# Altium schematic sheet Temp_sensor.SchDoc
size A4; SheetNumber: 4; SheetTotal: 7
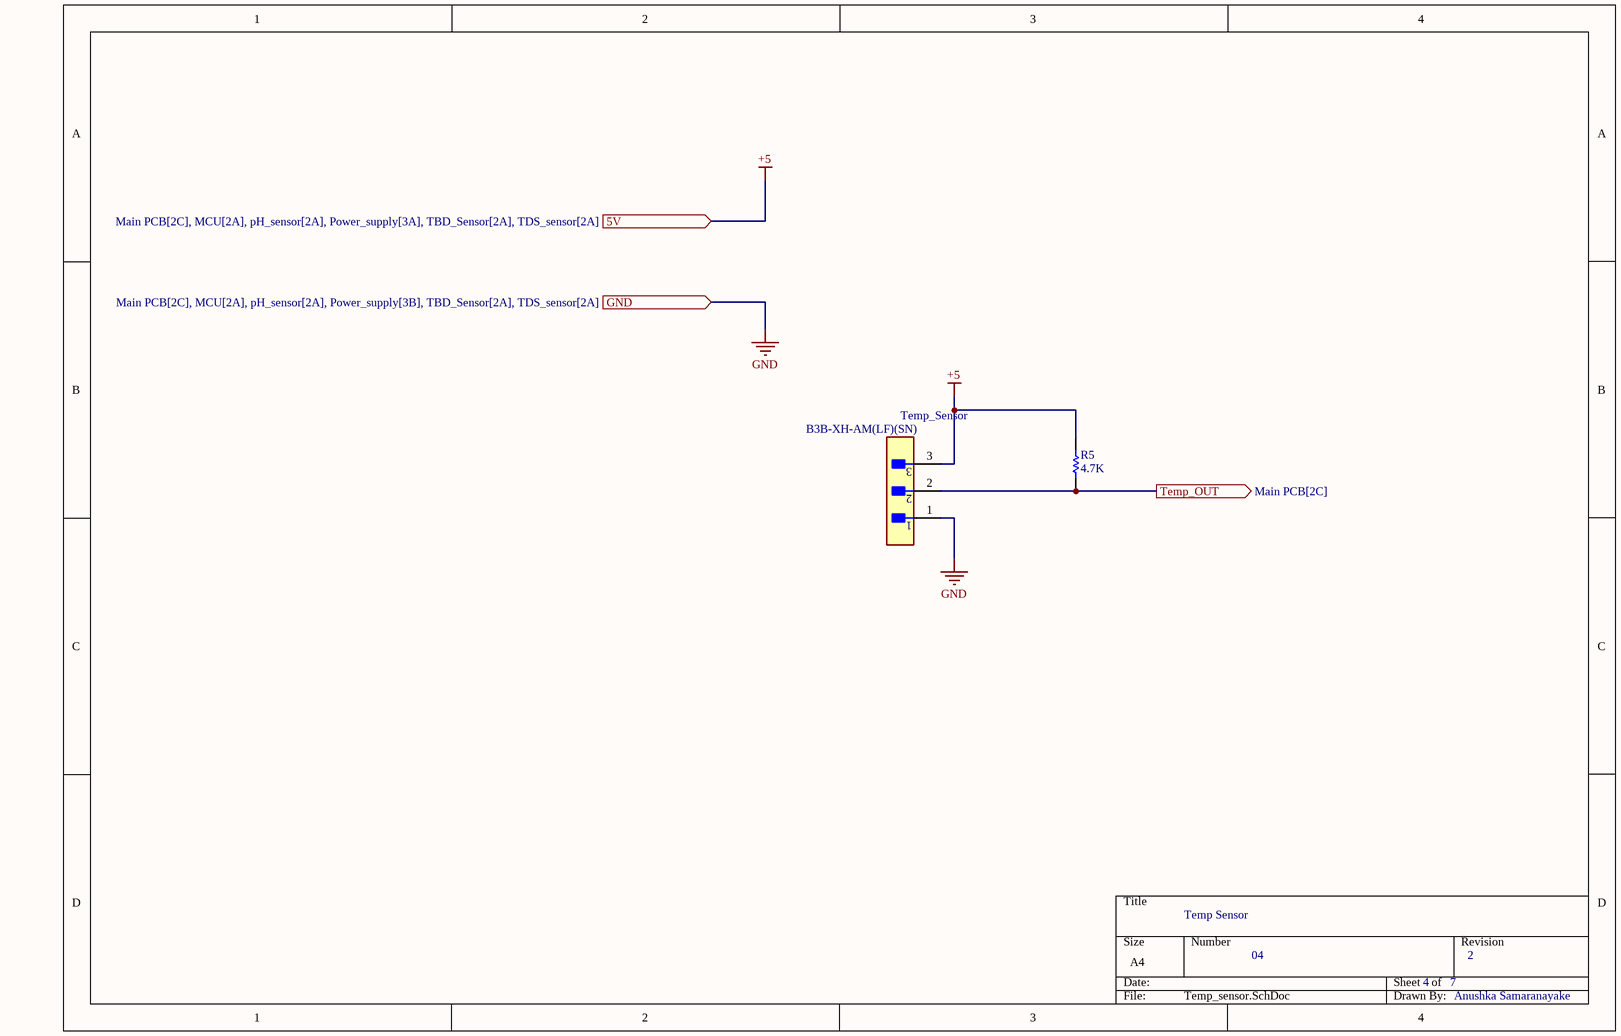
[diagram p0: Temp_sensor.SchDoc]

## Parts
R5  4.7K  [RESC3216X70X50LL20T25]
Temp_Sensor  B3B-XH-AM(LF)(SN)  [FP-B3B-XH-AM_LF_SN-MFG]

## Ports
5V (in, see Main PCB[2C], MCU[2A], pH_sensor[2A], Power_supply[3A], TBD_Sensor[2A], TDS_sensor[2A]), GND (in, see Main PCB[2C], MCU[2A], pH_sensor[2A], Power_supply[3B], TBD_Sensor[2A], TDS_sensor[2A]), Temp_OUT (out, see Main PCB[2C])

## Nets
+5: R5.1 Temp_Sensor.3 ; port 5V
GND: Temp_Sensor.1 ; port GND
Temp_OUT: R5.2 Temp_Sensor.2 ; port Temp_OUT

## Notes on the sheet
- Temp Sensor
- 04
- 4
- 7
- 2
- Anushka Samaranayake

## Library data of the parts
R5 = CMP-2003-04407-1: Manufacturer: Panasonic; Part Number: ERA8AEB103V
Temp_Sensor = CMP-17438-000009-1: CONN HEADER VERT 3POS 2.5MM; Max Current Rating: 3A; Gender: Male; Max Voltage Rating (AC): 250V; Connector Type: Male Pin; Pitch: 0.098inch; Number of Positions: 3; Contact Resistance: 20mR; Termination: Press-Fit; Housing Color: White; Housing Material: Polyamide; Orientation: Straight; Contact Material: Brass; Contact Type: Male Pin; Color: Natural; Packaging: Bulk; Lead Free: Lead Free; Depth: 5.75mm; Number of Rows: 1; Contact Plating: Tin; Length: 9.9mm; Max Operating Temperature: 85°C; Series: XH; Min Operating Temperature: -25°C; Fastening Type: Detent; Mount: Through Hole